# EAGLE schematic MMIrLedEm (EAGLE 7.2.0)
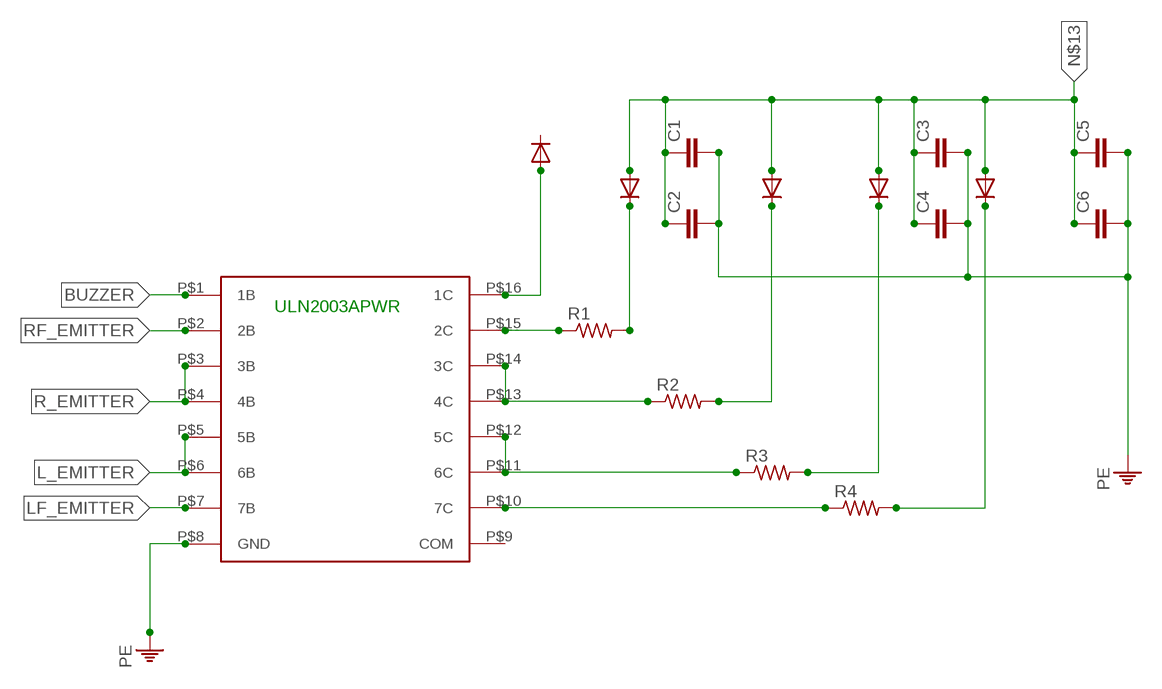
[diagram p0: schematic, sheet 1]

## Parts
C1  C-EUC1206  [C1206]
C2  C-EUC1206  [C1206]
C3  C-EUC1206  [C1206]
C4  C-EUC1206  [C1206]
C5  C-EUC1206  [C1206]
C6  C-EUC1206  [C1206]
R1  R-US_R1206  [R1206]
R2  R-US_R1206  [R1206]
R3  R-US_R1206  [R1206]
R4  R-US_R1206  [R1206]
U$1  ULN  [ULN]

## Nets
BUZZER: U$1.P$1(1B)
L_EMITTER: U$1.P$5(5B) U$1.P$6(6B)
LF_EMITTER: U$1.P$7(7B)
N$1: R1.1 U$1.P$15(2C)
N$2: R1.2
N$3: R2.1 U$1.P$13(4C) U$1.P$14(3C)
N$4: R2.2
N$5: R3.1 U$1.P$11(6C) U$1.P$12(5C)
N$6: R3.2
N$7: R4.2
N$8: R4.1 U$1.P$10(7C)
N$9: U$1.P$16(1C)
N$13: C1.1 C2.1 C3.1 C4.1 C5.1 C6.1
PE: C1.2 C2.2 C3.2 C4.2 C5.2 C6.2 U$1.P$8(GND)
R_EMITTER: U$1.P$3(3B) U$1.P$4(4B)
RF_EMITTER: U$1.P$2(2B)
Unconnected: U$1.P$9(COM)

## Notes on the sheet
- ULN2003APWR

## Library data of the parts
C1-C6 = resistor:C-EU: CAPACITOR, European symbol
R1-R4 = resistor:R-US_: RESISTOR, American symbol
U$1 = MMULN:ULN